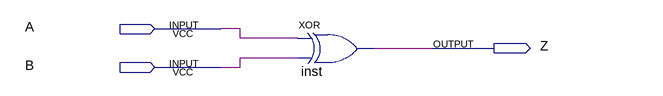
[diagram p0: schematic sheet]
// Quartus schematic sumador2bits.bdf as structural Verilog: 1 symbols, 3 pins
module sumador2bits (
  input  A,
  input  B,
  output Z
);

  xor inst (Z, A, B);
endmodule
